# Altium schematic sheet driverControlsMezzanine.SchDoc: Mezzanine Pinout
size Letter; Author: Norman Chong; Revision: 1.0; SheetNumber: 1; SheetTotal: 2; Website: www.uwmidsun.com; ProjectName: Driver Controls
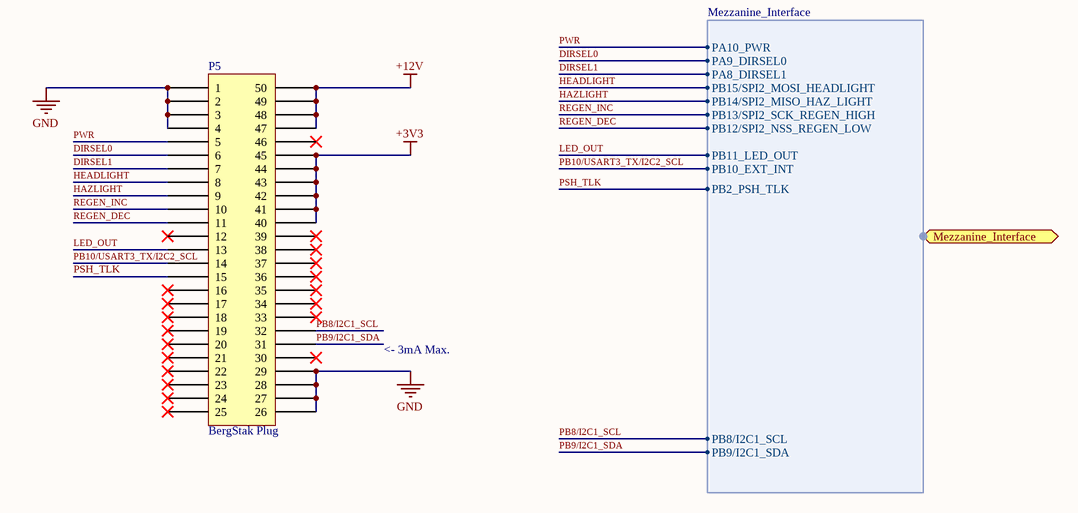
[diagram p0: driverControlsMezzanine.SchDoc]

## Parts
P5  BergStak Plug  [CONN, Bergstak 50 Pos Plug]

## Ports
Mezzanine_Interface (harness Mezzanine_Interface)

## Harnesses
Mezzanine_Interface: PA10_PWR, PA9_DIRSEL0, PA8_DIRSEL1, PB15/SPI2_MOSI_HEADLIGHT, PB14/SPI2_MISO_HAZ_LIGHT, PB13/SPI2_SCK_REGEN_HIGH, PB12/SPI2_NSS_REGEN_LOW, PB11_LED_OUT, PB10_EXT_INT, PB8/I2C1_SCL, PB9/I2C1_SDA, PB2_PSH_TLK

## Nets
+3V3: P5.40 P5.41 P5.42 P5.43 P5.44 P5.45
+12V: P5.47 P5.48 P5.49 P5.50
GND: P5.1 P5.2 P5.3 P5.4 P5.26 P5.27 P5.28 P5.29
DIRSEL0: P5.6 ; port Mezzanine_Interface.PA9_DIRSEL0
DIRSEL1: P5.7 ; port Mezzanine_Interface.PA8_DIRSEL1
HAZLIGHT: P5.9 ; port Mezzanine_Interface.PB14/SPI2_MISO_HAZ_LIGHT
HEADLIGHT: P5.8 ; port Mezzanine_Interface.PB15/SPI2_MOSI_HEADLIGHT
LED_OUT: P5.13 ; port Mezzanine_Interface.PB11_LED_OUT
PB8/I2C1_SCL: P5.32 ; port Mezzanine_Interface.PB8/I2C1_SCL
PB9/I2C1_SDA: P5.31 ; port Mezzanine_Interface.PB9/I2C1_SDA
PB10/USART3_TX/I2C2_SCL: P5.14 ; port Mezzanine_Interface.PB10_EXT_INT
PSH_TLK: P5.15 ; port Mezzanine_Interface.PB2_PSH_TLK
PWR: P5.5 ; port Mezzanine_Interface.PA10_PWR
REGEN_DEC: P5.11 ; port Mezzanine_Interface.PB12/SPI2_NSS_REGEN_LOW
REGEN_INC: P5.10 ; port Mezzanine_Interface.PB13/SPI2_SCK_REGEN_HIGH

Not connected (* = marked no-connect by the designer): P5 12* 16* 17* 18* 19* 20* 21* 22* 23* 24* 25* 30* 33* 34* 35* 36* 37* 38* 39* 46*

## Notes on the sheet
- <- 3mA Max.
- Project:
- Title:
- Size:
- Project Lead:
- Letter
- Revision:
- University of Waterloo
- 200 University Ave W
- Waterloo, ON, Canada
- N2L 3E9
- Date:
- Sheet
- of
- Website:

## Library data of the parts
P5 = BergStak 50 Position Connector Plug: 50 Position Connector Plug, Outer Shroud Contacts Surface Mount Gold; Manufacturer PN: 10132797-055100LF; Digikey PN: 609-5226-1-ND